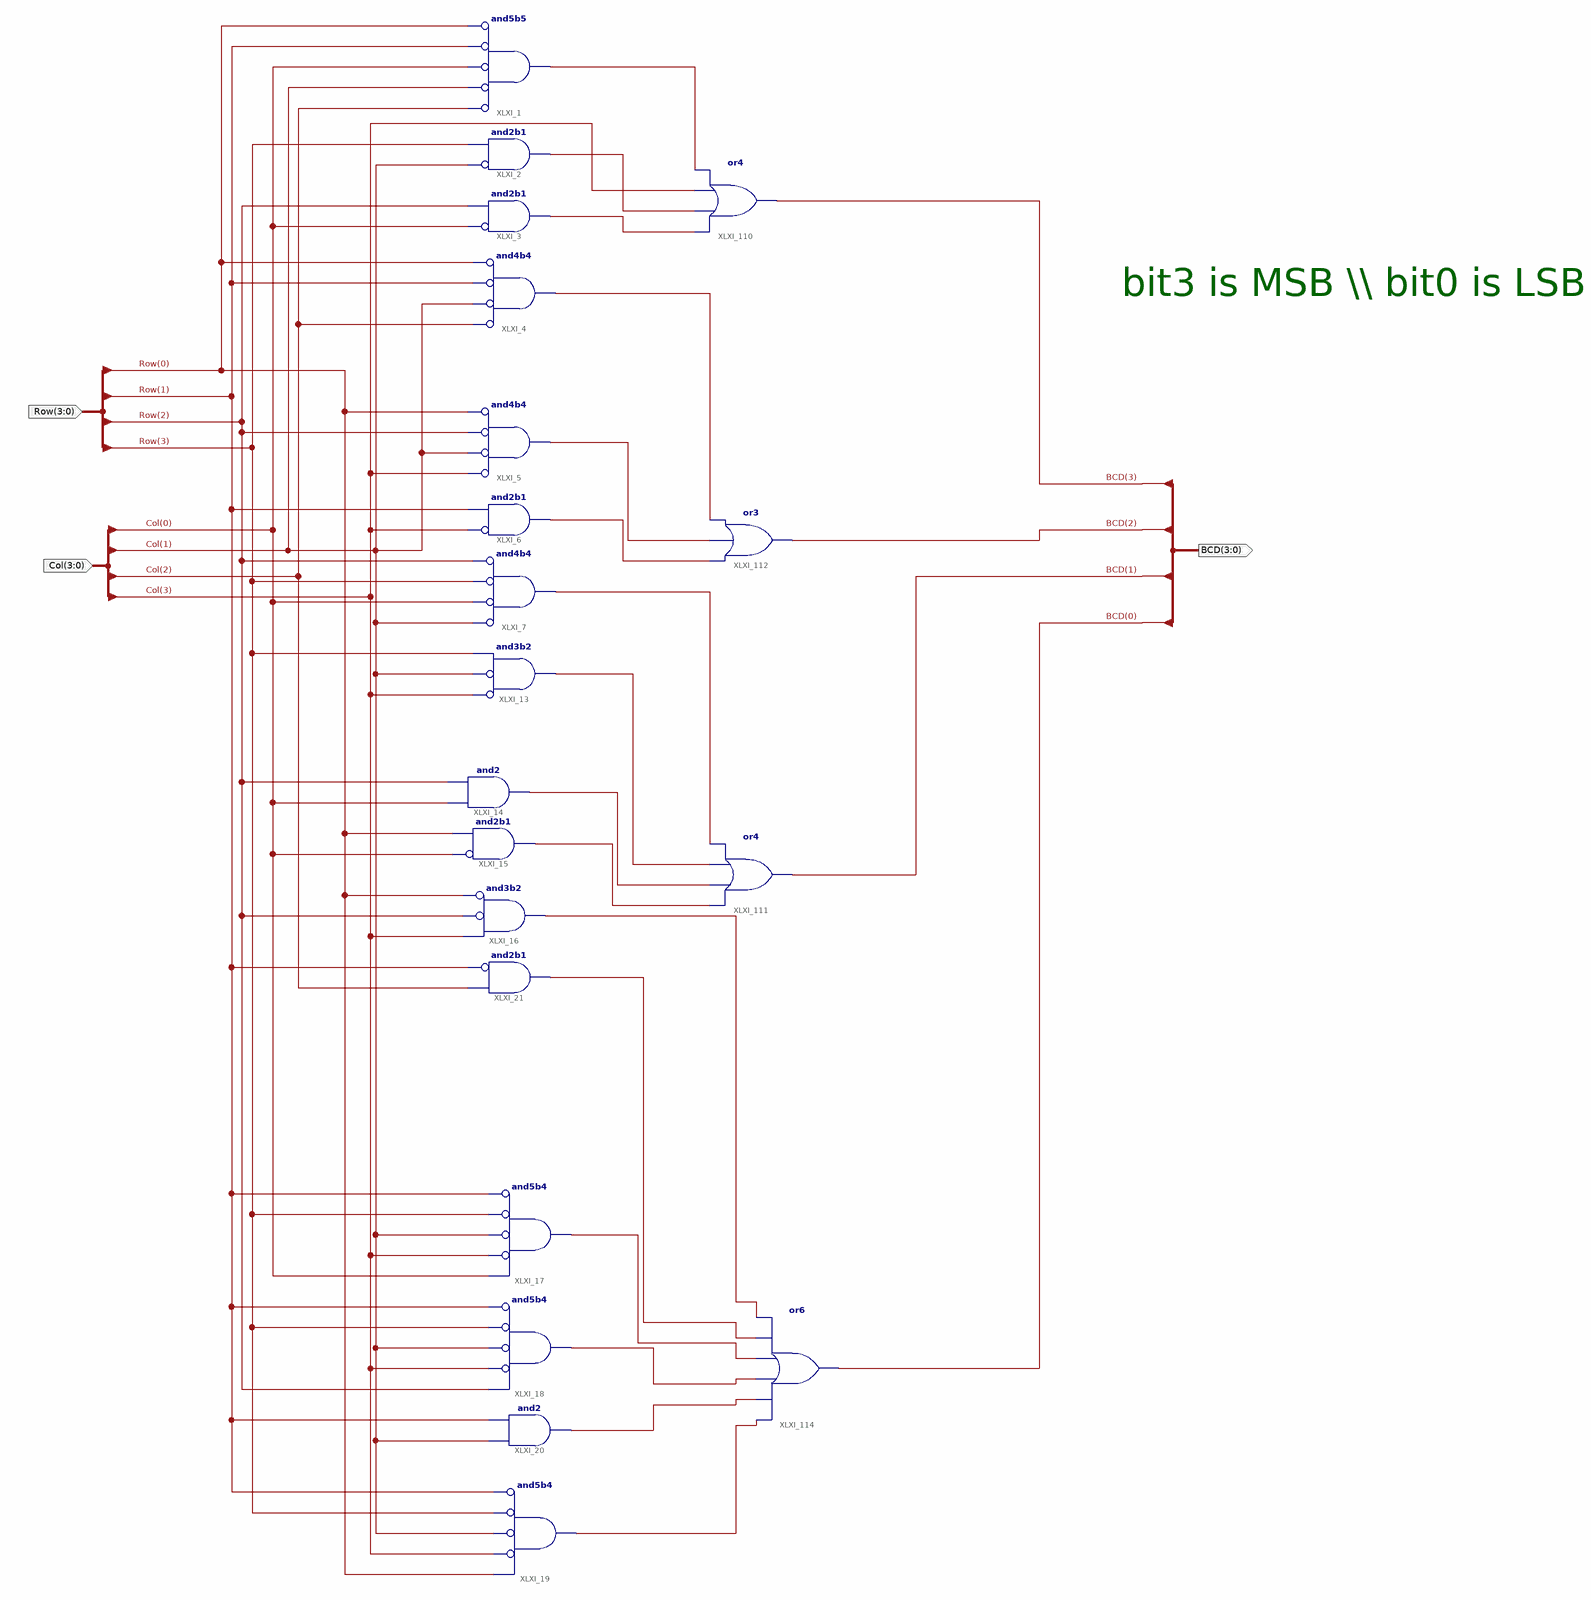
[diagram p0: schematic sheet 1]
// Xilinx ISE schematic numBCD.sch (spartan6) as structural Verilog: 20 symbols, 3 ports
module numBCD (
  input  [3:0] Row,
  input  [3:0] Col,
  output [3:0] BCD
);

  wire XLXN_54, XLXN_56, XLXN_57, XLXN_58, XLXN_59, XLXN_60, XLXN_61, XLXN_62, XLXN_63, XLXN_64, XLXN_73,
       XLXN_74, XLXN_75, XLXN_76, XLXN_77, XLXN_78;

  and XLXI_1 (XLXN_54, ~Col[2], ~Col[1], ~Col[0], ~Row[1], ~Row[0]);  // and5b5
  and XLXI_3 (XLXN_57, ~Col[0], Row[2]);  // and2b1
  and XLXI_4 (XLXN_58, ~Col[2], ~Col[1], ~Row[1], ~Row[0]);  // and4b4
  and XLXI_5 (XLXN_59, ~Col[3], ~Col[1], ~Row[2], ~Row[0]);  // and4b4
  and XLXI_6 (XLXN_60, ~Col[3], Row[1]);  // and2b1
  and XLXI_7 (XLXN_61, ~Col[1], ~Col[0], ~Row[3], ~Row[2]);  // and4b4
  and XLXI_13 (XLXN_62, ~Col[3], ~Col[1], Row[3]);  // and3b2
  and XLXI_21 (XLXN_74, ~Row[1], Col[2]);  // and2b1
  and XLXI_16 (XLXN_73, ~Row[0], ~Row[2], Col[3]);  // and3b2
  and XLXI_15 (XLXN_64, ~Col[0], Row[0]);  // and2b1
  and XLXI_14 (XLXN_63, Col[0], Row[2]);
  and XLXI_19 (XLXN_78, ~Row[1], ~Row[3], ~Col[1], ~Col[3], Row[0]);  // and5b4
  and XLXI_20 (XLXN_77, Col[1], Row[1]);
  and XLXI_17 (XLXN_75, ~Row[1], ~Row[3], ~Col[1], ~Col[3], Col[0]);  // and5b4
  and XLXI_18 (XLXN_76, ~Row[1], ~Row[3], ~Col[1], ~Col[3], Row[2]);  // and5b4
  and XLXI_2 (XLXN_56, ~Col[1], Row[3]);  // and2b1
  or XLXI_110 (BCD[3], XLXN_54, Col[3], XLXN_56, XLXN_57);
  or XLXI_111 (BCD[1], XLXN_61, XLXN_62, XLXN_63, XLXN_64);
  or XLXI_112 (BCD[2], XLXN_58, XLXN_59, XLXN_60);
  or XLXI_114 (BCD[0], XLXN_73, XLXN_74, XLXN_75, XLXN_76, XLXN_77, XLXN_78);

  // Notes on the sheet:
  //   bit3 is MSB \\ bit0 is LSB
endmodule
